# Altium schematic sheet dsPIC_reciver_sch.SchDoc: PRIJEMNIK
size A3; Organization: Altium Limited; Address1: L3, 12a Rodborough Rd; Address2: Frenchs Forest; Address3: NSW; Address4: Australia 2086; DocumentNumber: 1; Revision: V1; SheetNumber: 1; SheetTotal: 1
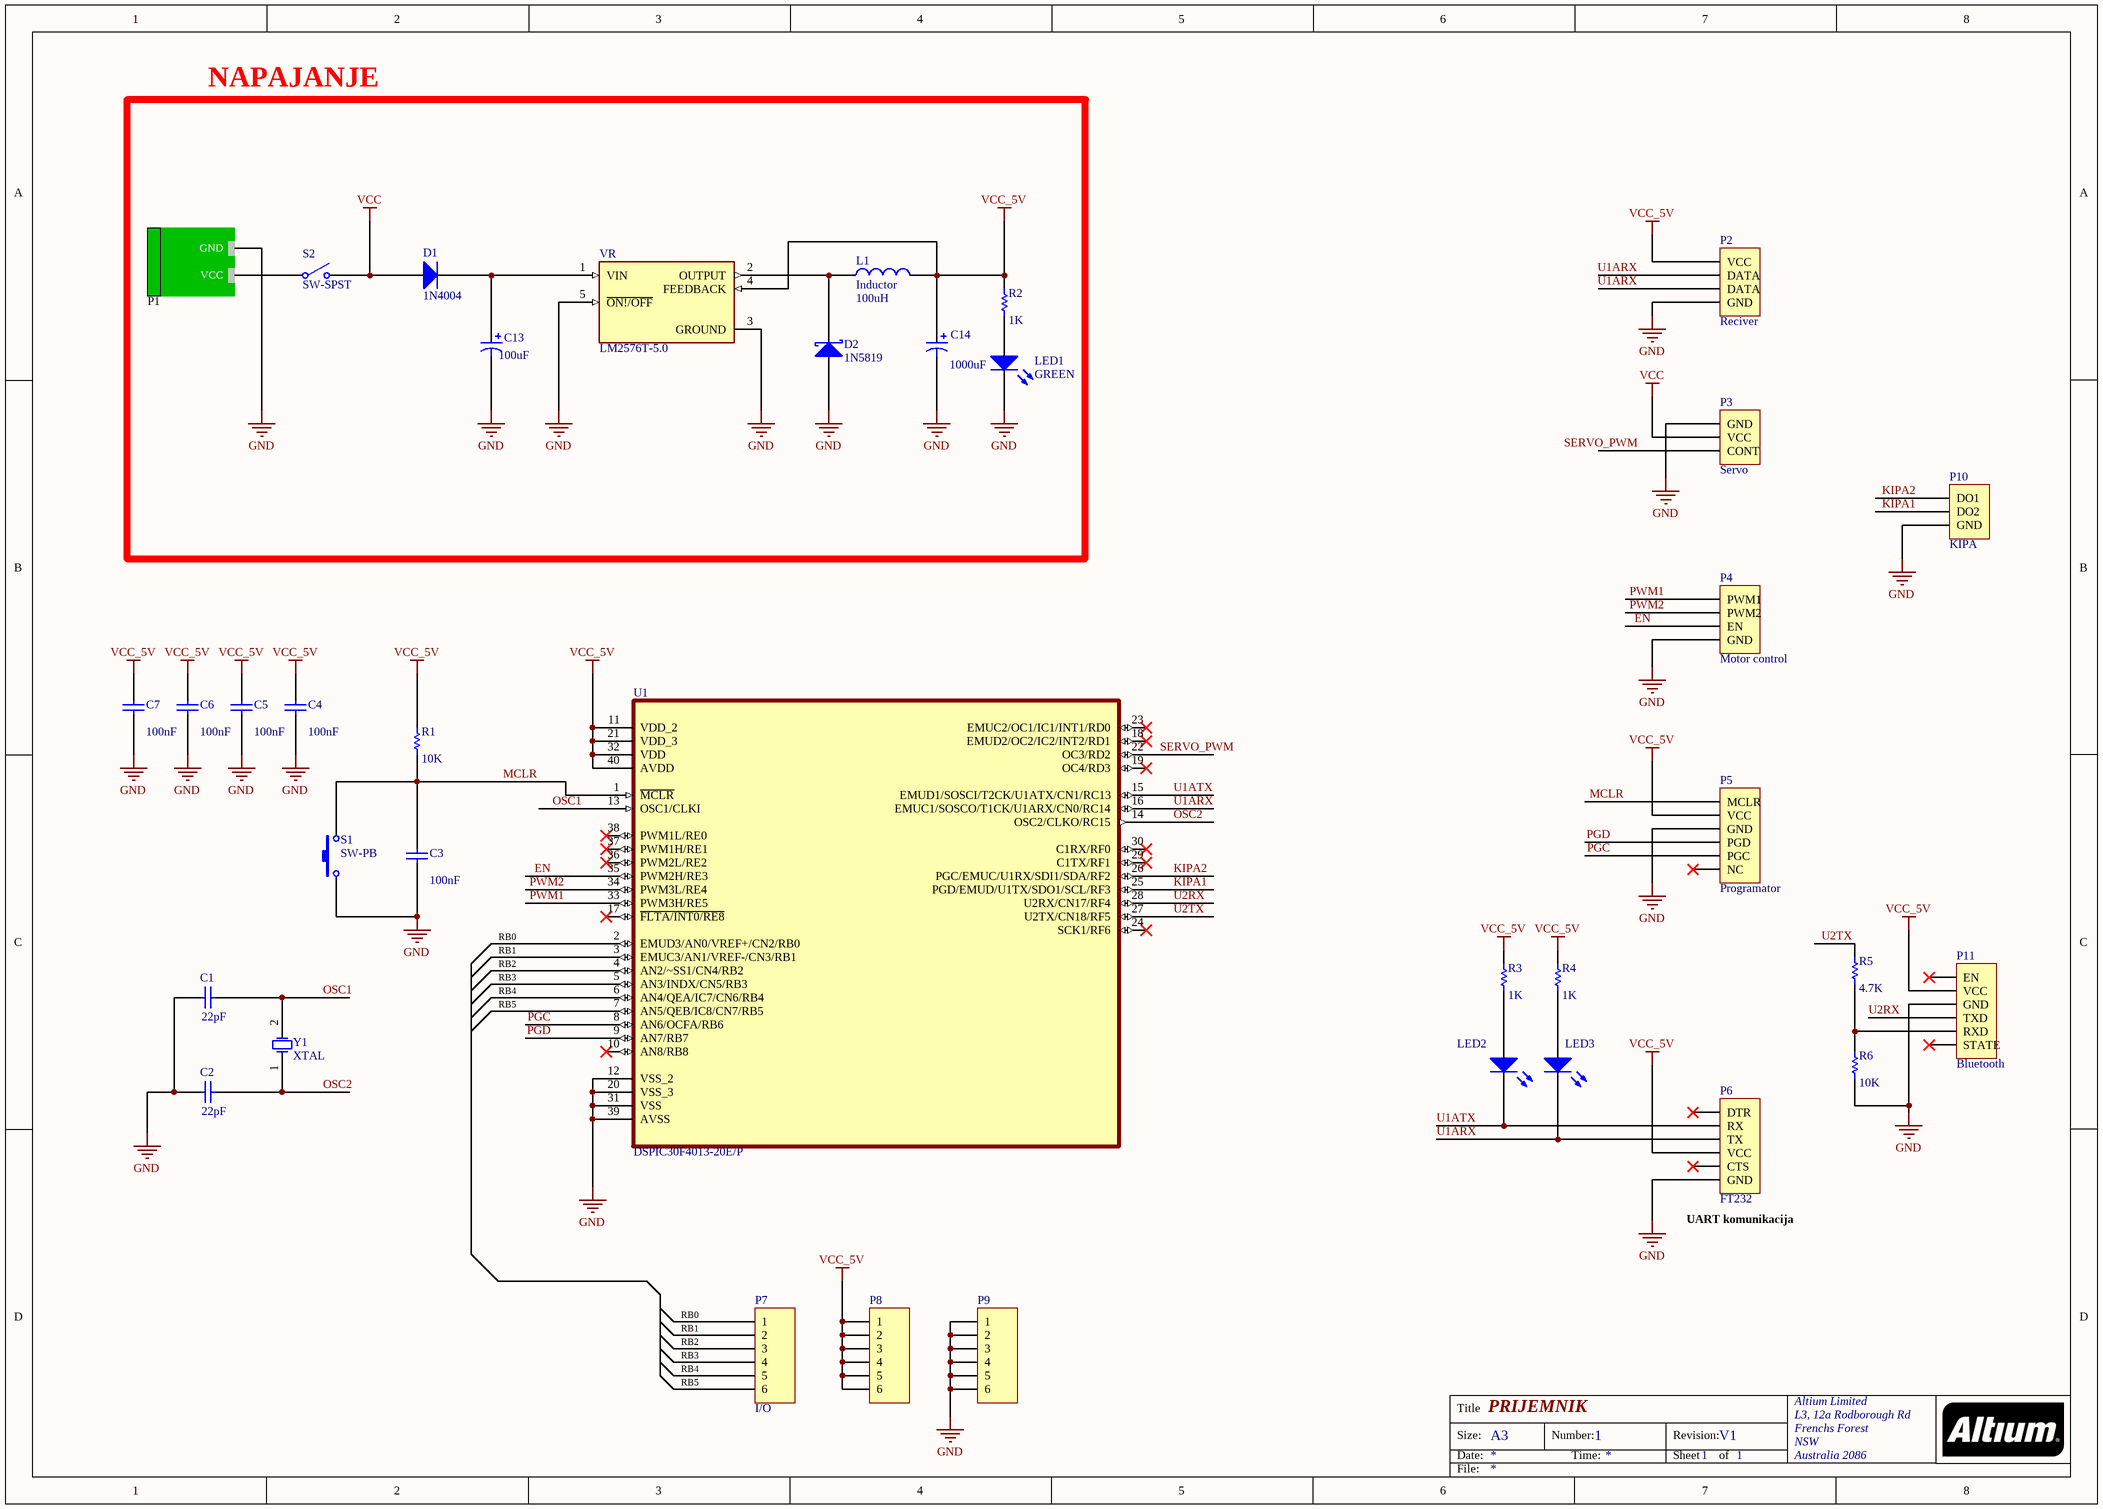
[diagram p0: dsPIC_reciver_sch.SchDoc]

## Parts
C1  value 22pF  [CAP200]  (hidden comment: Cap)
C2  value 22pF  [CAP200]  (hidden comment: Cap)
C3  value 100nF  [CAP200]  (hidden comment: Cap)
C4  value 100nF  [CAP200]  (hidden comment: Cap)
C5  value 100nF  [CAP200]  (hidden comment: Cap)
C6  value 100nF  [CAP200]  (hidden comment: Cap)
C7  value 100nF  [CAP200]  (hidden comment: Cap)
C13  value 100uF  [RAD4]  (hidden comment: Cap Pol1)
C14  value 1000uF  [RAD6_3]  (hidden comment: Cap Pol1)
D1  1N4004  [DIODE400]
D2  1N5819  [SDIODE300]
L1  Inductor  value 100uH  [INDUCTOR_9]
LED1  GREEN  [LED_2]
LED2  GREEN  [LED_2]  (value not drawn)
LED3  GREEN  [LED_2]  (value not drawn)
P1  2EDGRC-5.08-02P-14-00A(H)  [PWR_Con]  (value not drawn)
P2  Reciver  [HEADER_4]
P3  Servo  [HEADER_3]
P4  Motor control  [HEADER_4]
P5  Programator  [HEADER_6]
P6  FT232  [HEADER_6]
P7  I/O  [HEADER_6]
P8  Header 6  [HEADER_6]  (value not drawn)
P9  Header 6  [HEADER_6]  (value not drawn)
P10  KIPA  [HEADER_3]
P11  Bluetooth  [HEADER_6]
R1  value 10K  [RES400]  (hidden comment: Res1)
R2  value 1K  [RES400]  (hidden comment: Res1)
R3  value 1K  [RES400]  (hidden comment: Res1)
R4  value 1K  [RES400]  (hidden comment: Res1)
R5  value 4.7K  [RES400]  (hidden comment: Res1)
R6  value 10K  [RES400]  (hidden comment: Res1)
S1  SW-PB  [SPST-2]
S2  SW-SPST  [CAP200]
U1  DSPIC30F4013-20E/P  [DIP_40]
VR  LM2576T-5.0  [TO170P1067X483X1651-5]
Y1  XTAL  [OSC_5]

## Nets
GND: C1.1 C2.1 C3.1 C4.1 C5.1 C6.1 C7.1 C13.2 C14.2 D2.1(A) LED1.2(K) P1.1(GND) P2.4(GND) P3.1(GND) P4.4(GND) P5.3(GND) P6.6(GND) P9.1 P9.2 P9.3 P9.4 P9.5 P9.6 P10.3(GND) P11.3(GND) R6.1 S1.1 U1.12(VSS_2) U1.20(VSS_3) U1.31(VSS) U1.39(AVSS) VR.3(GROUND) VR.5(~{ON!/OFF})
VCC: D1.1(A) P3.2(VCC) S2.2(NO)
VCC_5V: C4.2 C5.2 C6.2 C7.2 C14.1 L1.2 P2.1(VCC) P5.2(VCC) P6.4(VCC) P8.1 P8.2 P8.3 P8.4 P8.5 P8.6 P11.2(VCC) R1.2 R2.2 R3.2 R4.2 U1.11(VDD_2) U1.21(VDD_3) U1.32(VDD) U1.40(AVDD) VR.4(FEEDBACK)
EN: P4.3(EN) U1.35(PWM2H/RE3)
KIPA1: P10.2(DO2) U1.25(PGD/EMUD/U1TX/SDO1/SCL/RF3)
KIPA2: P10.1(DO1) U1.26(PGC/EMUC/U1RX/SDI1/SDA/RF2)
MCLR: C3.2 P5.1(MCLR) R1.1 S1.2 U1.1(~{MCLR})
OSC1: C1.2 U1.13(OSC1/CLKI) Y1.2(OSC2)
OSC2: C2.2 U1.14(OSC2/CLKO/RC15) Y1.1(OSC1)
PGC: P5.5(PGC) U1.8(AN6/OCFA/RB6)
PGD: P5.4(PGD) U1.9(AN7/RB7)
PWM1: P4.1(PWM1) U1.33(PWM3H/RE5)
PWM2: P4.2(PWM2) U1.34(PWM3L/RE4)
RB0: P7.1 U1.2(EMUD3/AN0/VREF+/CN2/RB0)
RB1: P7.2 U1.3(EMUC3/AN1/VREF-/CN3/RB1)
RB2: P7.3 U1.4(AN2/~SS1/CN4/RB2)
RB3: P7.4 U1.5(AN3/INDX/CN5/RB3)
RB4: P7.5 U1.6(AN4/QEA/IC7/CN6/RB4)
RB5: P7.6 U1.7(AN5/QEB/IC8/CN7/RB5)
SERVO_PWM: P3.3(CONT) U1.22(OC3/RD2)
U1ARX: LED3.2(K) P2.2(DATA) P2.3(DATA) P6.3(TX) U1.16(EMUC1/SOSCO/T1CK/U1ARX/CN0/RC14)
U1ATX: LED2.2(K) P6.2(RX) U1.15(EMUD1/SOSCI/T2CK/U1ATX/CN1/RC13)
U2RX: P11.4(TXD) U1.28(U2RX/CN17/RF4)
U2TX: R5.2 U1.27(U2TX/CN18/RF5)
NetC13_1: C13.1 D1.2(K) VR.1(VIN)
NetD2_2: D2.2(K) L1.1 VR.2(OUTPUT)
NetLED1_1: LED1.1(A) R2.1
NetLED2_1: LED2.1(A) R3.1
NetLED3_1: LED3.1(A) R4.1
NetP1_2: P1.2(VCC) S2.1(COMMON)
NetP11_5: P11.5(RXD) R5.1 R6.2

Not connected (* = marked no-connect by the designer): P5 6(NC)*; P6 1(DTR)* 5(CTS)*; P11 1(EN)* 6(STATE)*; U1 10(AN8/RB8)* 17(~{FLTA/INT0/RE8})* 18(EMUD2/OC2/IC2/INT2/RD1)* 19(OC4/RD3)* 23(EMUC2/OC1/IC1/INT1/RD0)* 24(SCK1/RF6)* 29(C1TX/RF1)* 30(C1RX/RF0)* 36(PWM2L/RE2)* 37(PWM1H/RE1)* 38(PWM1L/RE0)*

## Notes on the sheet
- NAPAJANJE
- (near P6) UART komunikacija
- Title
- Size:
- Date:
- A3
- Number:
- Time:
- Revision:
- Sheet
- of
- File:

## Library data of the parts
C1-C7 = Cap: Capacitor; Published: 8-Jun-2000; LatestRevisionDate: 17-Jul-2002; LatestRevisionNote: Re-released for DXP Platform.; PackageReference: RAD-0.3; Publisher: Altium Limited; PackageDescription: Radial Cap, Thru-Hole; 2 Leads; 0.3 in Pin Spacing
C13 C14 = Cap Pol1: Polarized Capacitor (Radial); Published: 8-Jun-2000; LatestRevisionDate: 17-Jul-2002; LatestRevisionNote: Re-released for DXP Platform.; PackageReference: RB7.6-15; Publisher: Altium Limited; PackageDescription: Polarized Capacitor (Radial); 2 Leads
D1 = Diode 1N4004: 1 Amp General Purpose Rectifier; Published: 8-Jun-2000; LatestRevisionDate: 17-Jul-2002; LatestRevisionNote: Re-released for DXP Platform.; DatasheetVersion: 1998; PackageVersion: Aug-1999; PackageReference: DO-41; Publisher: Altium Limited; PackageDescription: Diode, Axial; Body 5.2 x 2.7 mm (LxDia. max), Lead Dia. 0.86 mm (max); Code_JEDEC: DO-204-AL; ComponentLink1Description: Manufacturer Link; ComponentLink1URL: http://www.fairchildsemi.com/; ComponentLink2Description: Datasheet; ComponentLink2URL: http://www.fairchildsemi.com/ds/1N%2F1N4001.pdf
D2 = D Schottky: Schottky Diode; Published: 8-Jun-2000; LatestRevisionDate: 17-Jul-2002; LatestRevisionNote: Re-released for DXP Platform.; PackageReference: SMB; Publisher: Altium Limited; PackageDescription: DO-214-AA/SMB; 2 C-Bend Leads; Body 5.3 x 3.6 mm, inc. leads (LxW); Code_JEDEC: DO-214-AA
L1 = Inductor: Code_IEC: 1005; Published: 8-Jun-2000; LatestRevisionDate: 29-May-2009; LatestRevisionNote: IPC-7351 Footprint Added.; PackageReference: 0402-A; Publisher: Altium Limited; PackageDescription: Chip Inductor; Code_JEITA: 0402
LED1-LED3 = LED1: Typical RED GaAs LED; Published: 8-Jun-2000; LatestRevisionDate: 08-Jul-2005; LatestRevisionNote: Mech Layer 1 removed.; PackageReference: LED-1; Publisher: Altium Limited; PackageDescription: LED; 2 Leads
P1 = 00000002: TERM BLOCK HDR 2POS 90DEG 5.08MM; Suplier: TME; Manufacturer Part Number: 2EDGRC-5.08-02P-14-00A(H); Suplier Product Link: https://www.tme.eu/en/details/2edgrc5.08-2p14/pluggable-terminal-blocks/degson-electronics/2edgrc-508-02p-14-00ah/; Price: 0.1304
P2 P4 = Header 4: Header, 4-Pin; LatestRevisionDate: 17-Jul-2002; LatestRevisionNote: Re-released for DXP Platform.; Publisher: Altium Limited
P3 P10 = Header 3: Header, 3-Pin; LatestRevisionDate: 17-Jul-2002; LatestRevisionNote: Re-released for DXP Platform.; Publisher: Altium Limited
P5-P9 P11 = Header 6: Header, 6-Pin; LatestRevisionDate: 17-Jul-2002; LatestRevisionNote: Re-released for DXP Platform.; Publisher: Altium Limited
R1-R6 = Res1: Resistor; Published: 8-Jun-2000; LatestRevisionDate: 17-Jul-2002; LatestRevisionNote: Re-released for DXP Platform.; PackageReference: AXIAL-0.3; Publisher: Altium Limited; PackageDescription: Axial Device, Thru-Hole; 2 Leads; 0.3 in Pin Spacing
S1 = SW-PB: Switch; Published: 24-Mar-1999; LatestRevisionDate: 17-Jul-2002; LatestRevisionNote: Re-released for DXP Platform.; PackageReference: SPST-2; Publisher: Altium Limited; PackageDescription: Switch; 2 Leads
S2 = SW-SPST: Single-Pole, Single-Throw Switch; Published: 24-Mar-1999; LatestRevisionDate: 17-Jul-2002; LatestRevisionNote: Re-released for DXP Platform.; PackageReference: SPST-2; Publisher: Altium Limited; PackageDescription: Switch; 2 Leads
U1 = DSPIC30F4013-20E/P: dsPIC dsPICâ„¢ 30F Microcontroller IC 16-Bit 20 MIPS 48KB _16K x 24_ FLASH 40-PDIP; MF: Microchip; Package: DIP-40 Microchip; Digi-Key_Part_Number: DSPIC30F4013-20EP-ND; Digi-Key_Purchase_URL: https://www.digikey.rs/product-detail/en/microchip-technology/DSPIC30F4013-20E-P/DSPIC30F4013-20EP-ND/739428?utm_source=snapeda&utm_medium=aggregator&utm_campaign=symbol; Value: *; MP: DSPIC30F4013-20E/P; SnapEDA_Link: https://www.snapeda.com/parts/DSPIC30F4013-20E/P/Microchip/view-part/143007/?ref=snap
VR = LM2576T-5.0: Conv DC-DC 4V to 40V Inv/Step Down Single-Out 5V 3A 5-Pin(5+Tab) TO-220 Tube; MF: HTC Korea; DigiKey-Purchase-URL: https://snapeda.com/shop?store=DigiKey&id=4830195; Package: None; Availability: Warning; SnapEDA_Link: https://www.snapeda.com/parts/LM2576T-5.0/HTC%20Korea/view-part/4830195/?ref=snap; MP: LM2576T-5.0; Mouser-Purchase-URL: https://snapeda.com/shop?store=Mouser&id=4830195; Value: *; Price: None; BuyPart: https://www.snapeda.com/parts/LM2576T-5.0/HTC%20Korea/view-part/4830195/?ref=eda
Y1 = XTAL: Crystal Oscillator; Published: 8-Jun-2000; LatestRevisionDate: 17-Jul-2002; LatestRevisionNote: Re-released for DXP Platform.; PackageReference: R38; Publisher: Altium Limited; PackageDescription: Crystal, Thru-Hole; 2 Leads; Body 3.1 x 8.2 mm (Dia.xH)